# EAGLE design qcopter_lib_bb (EAGLE 7.5.0)
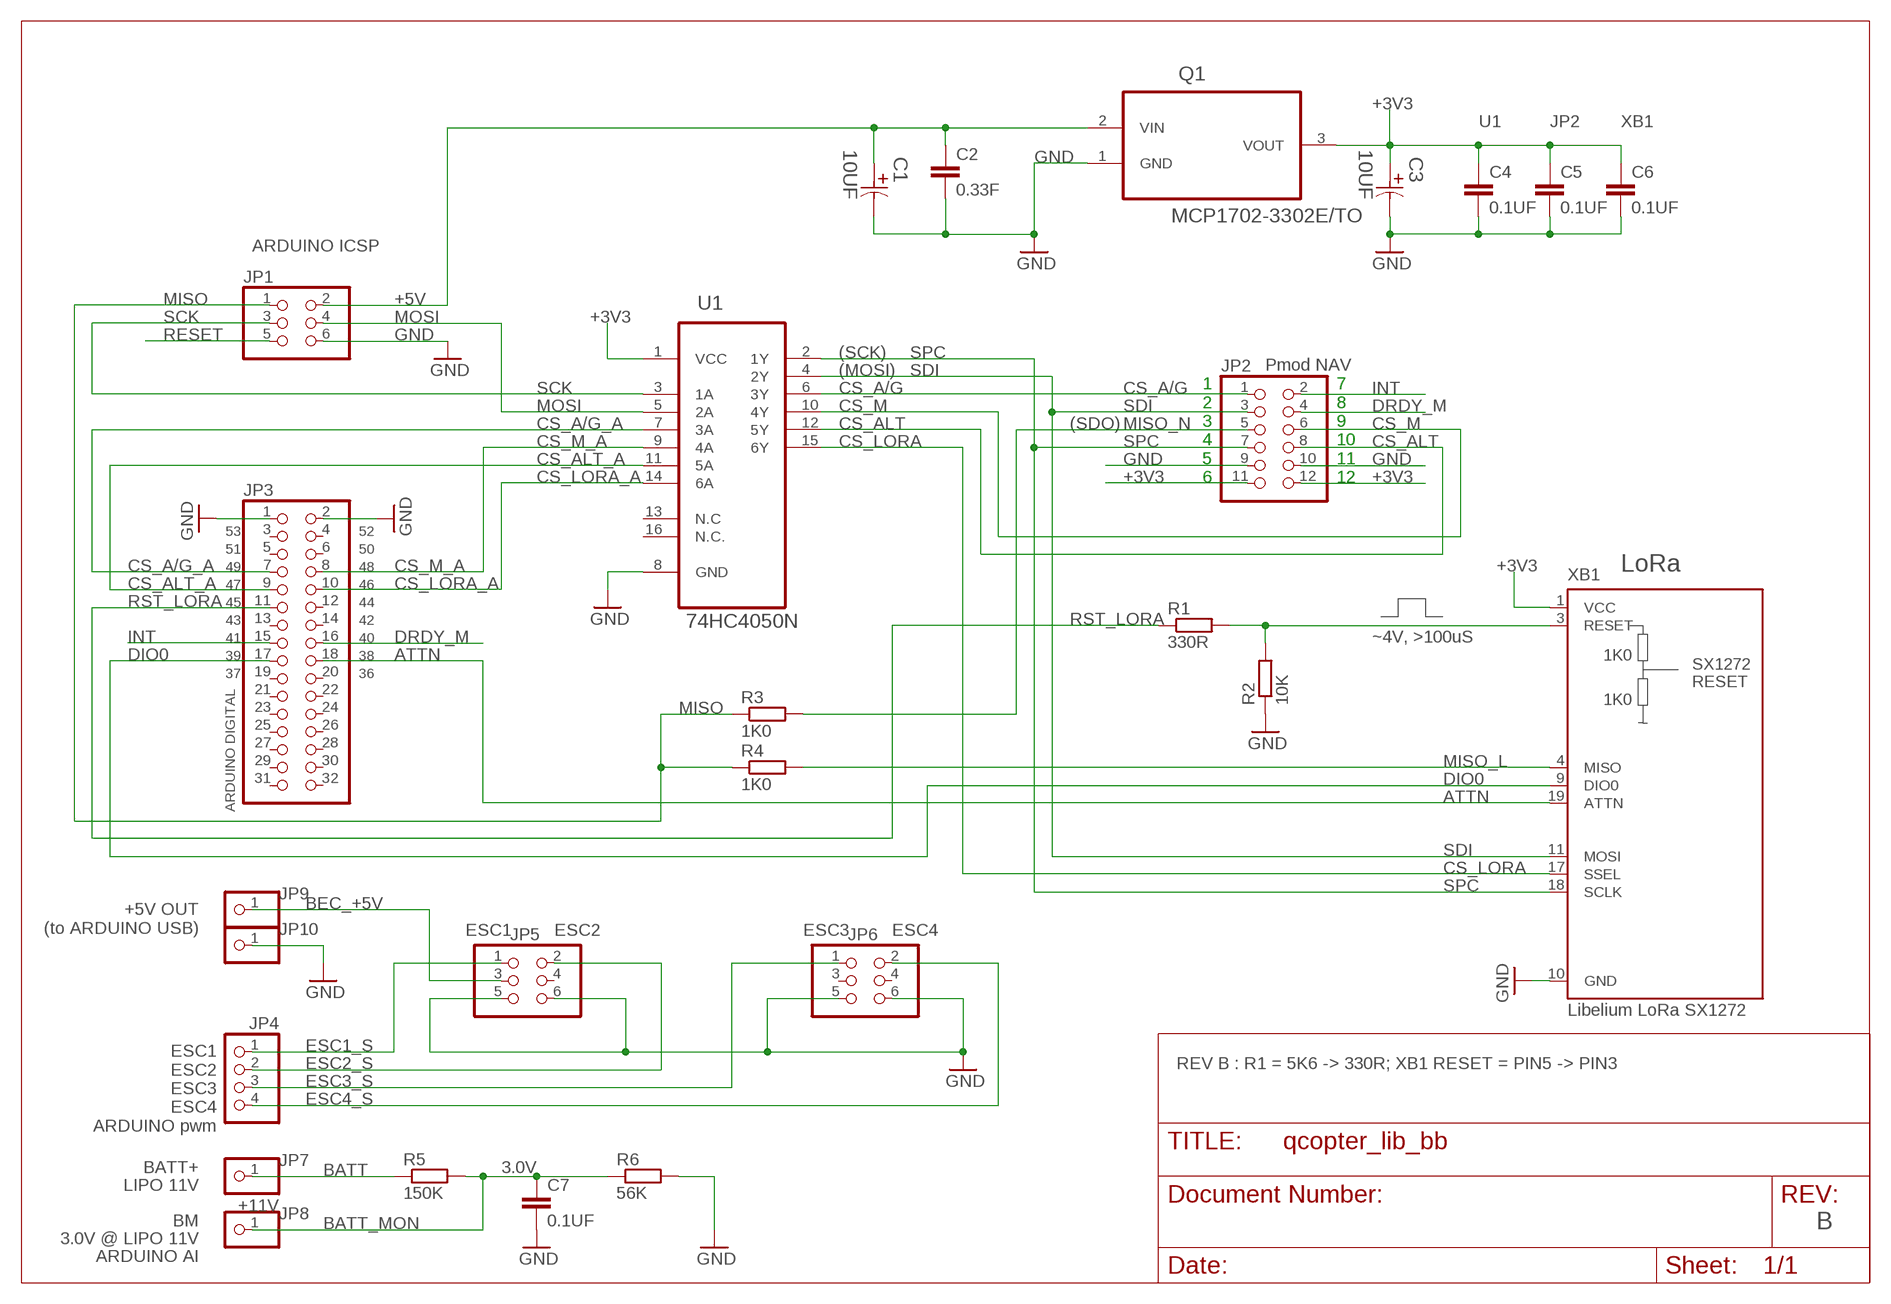
[diagram p0: schematic, sheet 1]

## Parts
C1  10UF  ECA1EHG470-D5XP2  [CAPPR200-500X1100]
C2  0.33F  C5/2.5  [C5B2.5]
C3  10UF  ECA1EHG470-D5XP2  [CAPPR200-500X1100]
C4  0.1UF  C5/2.5  [C5B2.5]
C5  0.1UF  C5/2.5  [C5B2.5]
C6  0.1UF  C5/2.5  [C5B2.5]
C7  0.1UF  C5/2.5  [C5B2.5]
JP1  PINHD-2X3  [2X03]
JP2  PINHD-2X6/90  [2X06/90]
JP3  PINHD-2X16  [2X16]
JP4  PINHD-1X4  [1X04]
JP5  PINHD-2X3  [2X03]
JP6  PINHD-2X3  [2X03]
JP7  +11V  PINHD-1X1  [1X01]
JP8  PINHD-1X1  [1X01]
JP9  PINHD-1X1  [1X01]
JP10  PINHD-1X1  [1X01]
Q1  MCP1702-3302E/TO  [TO127P254X533-3]
R1  330R  R-EU_0207/10  [0207/10]
R2  10K  R-EU_0207/10  [0207/10]
R3  1K0  R-EU_0207/10  [0207/10]
R4  1K0  R-EU_0207/10  [0207/10]
R5  150K  R-EU_0207/10  [0207/10]
R6  56K  R-EU_0207/10  [0207/10]
U1  74HC4050N  [DIP254P762X420-16]
XB1  Libelium LoRa SX1272  SX1272-LORA  [XBEE]

## Nets
+3V3: C3.1 C4.1 C5.1 C6.1 JP2.11 JP2.12 Q1.3(VOUT) U1.1(VCC) XB1.1(VCC)
+5V: C1.1 C2.1 JP1.2 Q1.2(VIN)
ATTN: JP3.18 XB1.19(ATTN)
BATT: JP7.1 R5.1
BATT_MON: C7.1 JP8.1 R5.2 R6.1
BEC_+5V: JP5.3 JP9.1
CS_A/G: JP2.1 U1.6(3Y)
CS_A/G_A: JP3.7 U1.7(3A)
CS_ALT: JP2.8 U1.12(5Y)
CS_ALT_A: JP3.9 U1.11(5A)
CS_LORA: U1.15(6Y) XB1.17(SSEL)
CS_LORA_A: JP3.10 U1.14(6A)
CS_M: JP2.6 U1.10(4Y)
CS_M_A: JP3.8 U1.9(4A)
DIO0: JP3.17 XB1.9(DIO0)
DRDY_M: JP2.4 JP3.16
ESC1_S: JP4.1 JP5.1
ESC2_S: JP4.2 JP5.2
ESC3_S: JP4.3 JP6.1
ESC4_S: JP4.4 JP6.2
GND: C1.2 C2.2 C3.2 C4.2 C5.2 C6.2 C7.2 JP1.6 JP2.9 JP2.10 JP3.1 JP3.2 JP5.5 JP5.6 JP6.5 JP6.6 JP10.1 Q1.1(GND) R2.1 R6.2 U1.8(GND) XB1.10(GND)
INT: JP2.2 JP3.15
MISO: JP1.1 R3.1 R4.1
MISO_L: R4.2 XB1.4(MISO)
MISO_N: JP2.5 R3.2
MOSI: JP1.4 U1.5(2A)
N$1: R1.2 R2.2 XB1.3(RESET)
RESET: JP1.5
RST_LORA: JP3.11 R1.1
SCK: JP1.3 U1.3(1A)
SDI: JP2.3 U1.4(2Y) XB1.11(MOSI)
SPC: JP2.7 U1.2(1Y) XB1.18(SCLK)
Unconnected: JP3.3 JP3.4 JP3.5 JP3.6 JP3.12 JP3.13 JP3.14 JP3.19 JP3.20 JP3.21 JP3.22 JP3.23 JP3.24 JP3.25 JP3.26 JP3.27 JP3.28 JP3.29 JP3.30 JP3.31 JP3.32 JP5.4 JP6.3 JP6.4 U1.13(N.C) U1.16(N.C.)

## Notes on the sheet
- U1 | JP2 | XB1
- ARDUINO ICSP
- (SCK) | Pmod NAV
- (MOSI)
- (SDO)
- 1
  2
  3
  4
  5
  6
- 7
  8
  9
  10
  11
  12
- 53 | 52
- 51 | 50
- 49 | 48 | LoRa
- 47 | 46
- 45 | 44
- 43 | 42
- 41 | 40 | ~4V, >100uS
- 39 | 38 | 1K0
- 37 | 36
- SX1272
  RESET
- 1K0
- ARDUINO DIGITAL
- +5V OUT
  (to ARDUINO USB)
- ESC1 | ESC2 | ESC3 | ESC4
- REV B : R1 = 5K6 -> 330R; XB1 RESET = PIN5 -> PIN3
- ESC1
  ESC2
  ESC3
  ESC4
  ARDUINO pwm
- BATT+ | 3.0V
- LIPO 11V
- BM
- B
- 3.0V @ LIPO 11V
- ARDUINO AI

## Library data of the parts
C1 C3 = Panasonic-ECA_01:ECA: Aluminum Electrolytic Capacitors/Radial Lead Type; MPN: ECA1EHG470; OC_FARNELL: 1848541; OC_NEWARK: 17T5002; PACKAGE: Radial Lead-TH; SUPPLIER: PANASONIC; TOLERANCE: ±20 %; VALUE: 47UF; VOLTAGERATING: 25V
C2 C4-C7 = capacitor-wima:C: CAPACITOR naming: grid - package width
JP1 JP5 JP6 = pinhead:PINHD-2X3: PIN HEADER
JP2 = pinhead:PINHD-2X6: PIN HEADER
JP3 = pinhead:PINHD-2X16: PIN HEADER
JP4 = pinhead:PINHD-1X4: PIN HEADER
JP7-JP10 = pinhead:PINHD-1X1: PIN HEADER
Q1 = Microchip-MCP1702-3302E-TO:MCP1702-3302E/TO: IC, V REG, LDO, 250MA; MPN: MCP1702-3302E/TO; OC_FARNELL: 1331485; OC_NEWARK: 34M7419; PACKAGE: TO-92; SUPPLIER: Microchip
R1-R6 = resistor:R-EU_: RESISTOR, European symbol
U1 = 74HC4050_DIP16:74HC4050N: Hex high-to-low level shifter,DIP-16; MPN: 74HC4050N; OC_FARNELL: 380908; OC_NEWARK: 07WX3736; PACKAGE: DIP-16; SUPPLIER: NXP
XB1 = xbee_lora:SX1272-LORA

## Board
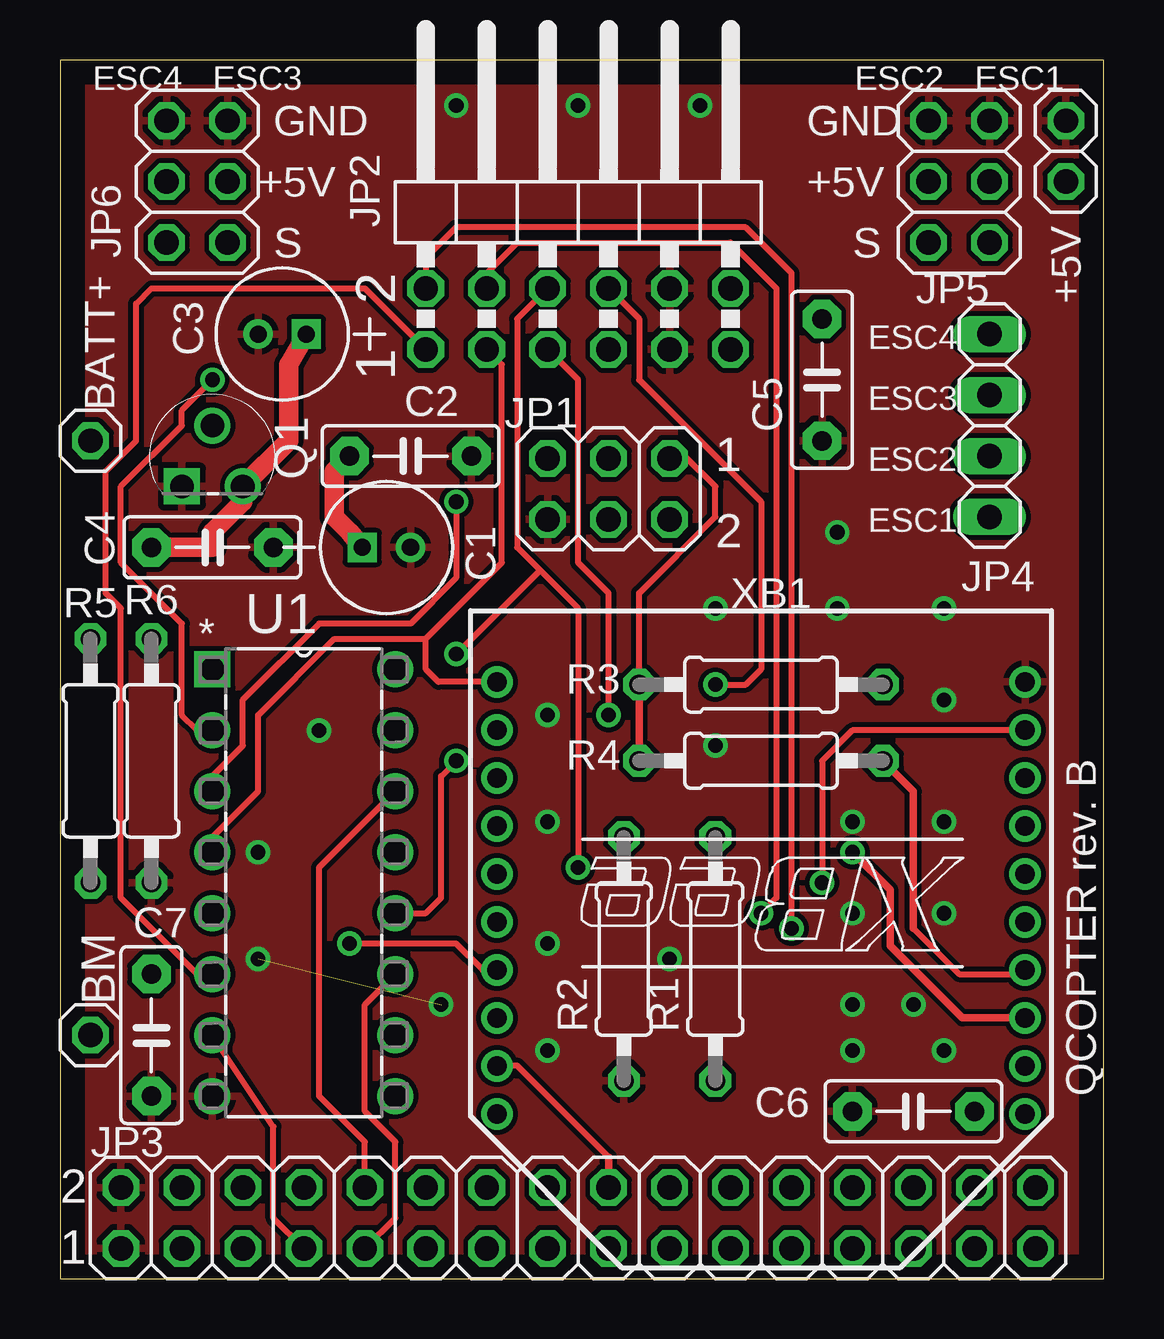
[diagram p1: board, top side]
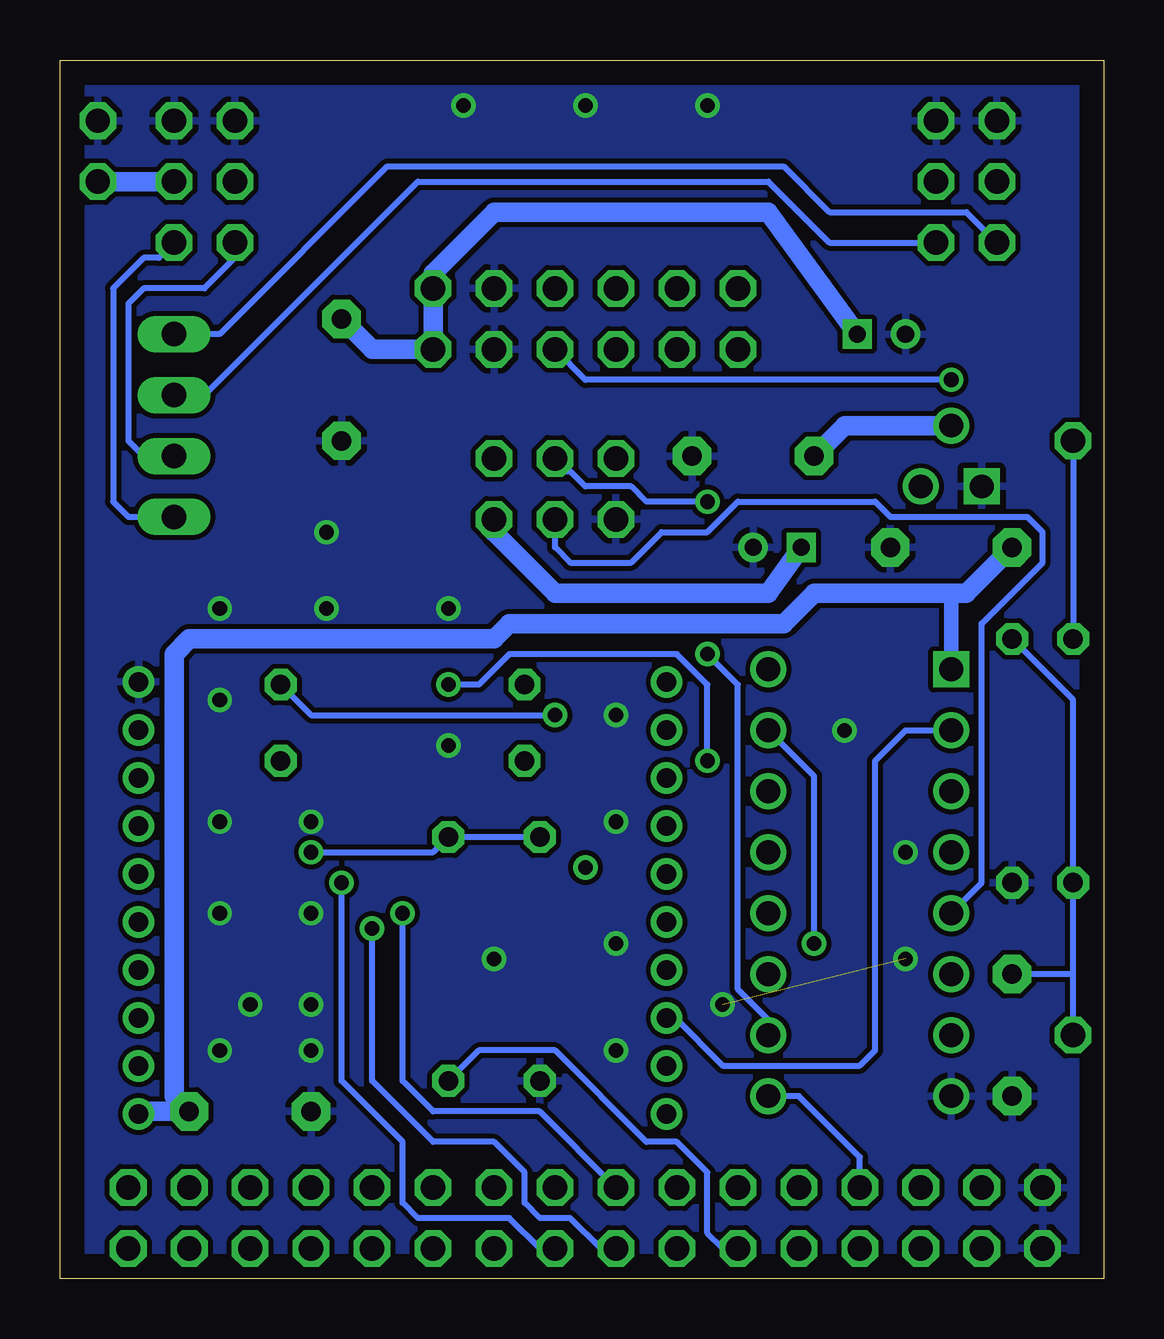
[diagram p2: board, bottom side, seen from below]

Size 43.48 x 50.79 mm. Coordinates in mm from the lower left corner, seen from the top.
Outline: 0,0 43.48,0 43.48,50.79 0,50.79 0,0
Copper layers (1*16): Top 0.035mm / dielectric 1.5mm / Bottom 0.035mm
Design rules "default": minimum track width 10mil, minimum drill 24mil, track to track 8mil, track to pad 8mil, pad to pad 8mil, via to via 8mil, smd to smd 8mil, copper to edge 40mil, drill to drill 8mil, minimum pad ring 10mil, minimum via ring 8mil, stop-mask expansion 4mil, vias tented up to drill 0mil, thermal gap 10mil

### Footprints (pad centres in the part's own frame; a part is rotated, then mirrored left to right if it is on the bottom)
CAPPR200-500X1100 = drill 0.711 square: 1 -2.007,0 | drill 0.711: 2 0,0
C5B2.5 = drill 0.813 pad 1.6 octagon: 1 -2.54,0; 2 2.54,0
2X03 = drill 1.016 octagon: 1 -2.54,-1.27; 2 -2.54,1.27; 3 0,-1.27; 4 0,1.27; 5 2.54,-1.27; 6 2.54,1.27
2X06/90 = drill 1.016 octagon: 1 -6.35,-6.35; 2 -6.35,-3.81; 3 -3.81,-6.35; 4 -3.81,-3.81; 5 -1.27,-6.35; 6 -1.27,-3.81; 7 1.27,-6.35; 8 1.27,-3.81; 9 3.81,-6.35; 10 3.81,-3.81; 11 6.35,-6.35; 12 6.35,-3.81
2X16 = drill 1.016 octagon: 1 -19.05,-1.27; 2 -19.05,1.27; 3 -16.51,-1.27; 4 -16.51,1.27; 5 -13.97,-1.27; 6 -13.97,1.27; 7 -11.43,-1.27; 8 -11.43,1.27; 9 -8.89,-1.27; 10 -8.89,1.27; 11 -6.35,-1.27; 12 -6.35,1.27; 13 -3.81,-1.27; 14 -3.81,1.27; 15 -1.27,-1.27; 16 -1.27,1.27; 17 1.27,-1.27; 18 1.27,1.27; 19 3.81,-1.27; 20 3.81,1.27; 21 6.35,-1.27; 22 6.35,1.27; 23 8.89,-1.27; 24 8.89,1.27; 25 11.43,-1.27; 26 11.43,1.27; 27 13.97,-1.27; 28 13.97,1.27; 29 16.51,-1.27; 30 16.51,1.27; 31 19.05,-1.27; 32 19.05,1.27
1X04 = drill 1.016 long: 1 -3.81,0; 2 -1.27,0; 3 1.27,0; 4 3.81,0
1X01 = drill 1.016 octagon: 1 0,0
TO127P254X533-3 = drill 0.991 square: 1 -2.54,-2.54 | drill 0.991: 2 -1.27,0; 3 0,-2.54
0207/10 = drill 0.813 octagon: 1 -5.08,0; 2 5.08,0
DIP254P762X420-16 = drill 0.991 square: 1 -7.62,17.78 | drill 0.991: 2 -7.62,15.24; 3 -7.62,12.7; 4 -7.62,10.16; 5 -7.62,7.62; 6 -7.62,5.08; 7 -7.62,2.54; 8 -7.62,0; 9 0,0; 10 0,2.54; 11 0,5.08; 12 0,7.62; 13 0,10.16; 14 0,12.7; 15 0,15.24; 16 0,17.78
XBEE = drill 0.8 pad 1.27: 1 -11,9; 2 -11,7; 3 -11,5; 4 -11,3; 5 -11,1; 6 -11,-1; 7 -11,-3; 8 -11,-5; 9 -11,-7; 10 -11,-9; 11 11,-9; 12 11,-7; 13 11,-5; 14 11,-3; 15 11,-1; 16 11,1; 17 11,3; 18 11,5; 19 11,7; 20 11,9

### Placement (x,y rotation side)
C1  14.61,30.48 0 top
C2  14.61,34.29 0 top
C3  8.26,39.37 180 top
C4  6.35,30.48 0 top
C5  31.75,37.47 270 top
C6  35.56,6.99 180 top
C7  3.81,10.16 270 top
JP1  22.86,32.92 180 top
JP2  21.59,45.09 0 top
JP3  21.59,2.54 0 top
JP4  38.73,35.56 90 top
JP5  37.47,45.72 90 top
JP6  5.71,45.72 90 top
JP7  1.27,34.92 0 top
JP8  1.27,10.16 0 top
JP9  41.91,45.72 0 top
JP10  41.91,48.26 0 top
Q1  7.62,35.56 0 top
R1  27.3,13.34 90 top
R2  23.5,13.34 90 top
R3  29.21,24.77 0 top
R4  29.21,21.59 0 top
R5  1.27,21.59 270 top
R6  3.81,21.59 270 top
U1  13.97,7.62 0 top
XB1  29.21,15.88 180 top

### Tracks (layer width: path | path; a pad name or v marks a point on that pad's centre or on a via)
+3V3
  Top 0.813: C4.1 6.35,30.48 6.35,31.11 7.62,32.38 Q1.3 9.53,34.92 9.53,38.1 C3.1
  Bottom 0.305: 40.1,6.99 XB1.1
  Bottom 0.61: U1.1 6.35,28.57
  Bottom 0.813: C4.1 5.71,28.57 6.35,28.57 12.06,28.57 13.34,27.3 24.77,27.3 25.4,26.67 38.1,26.67 38.73,26.04 38.73,7.62 C6.1 40.1,6.99 | C3.1 13.97,44.45 25.4,44.45 27.94,41.91 JP2.12 JP2.11 30.48,38.73 C5.1
+5V
  Top 0.813: C2.1 11.43,33.66 11.43,31.75 12.06,31.11 C1.1
  Bottom 0.813: Q1.2 10.79,35.56 C2.1 | C1.1 13.97,28.57 22.86,28.57 25.4,31.11 JP1.2
ATTN
  Top 0.254: 22.86,5.08 19.05,8.89 18.23,8.89
  Top 0.305: JP3.18 22.86,5.08 | 18.23,8.89 XB1.19
BATT
  Bottom 0.254: JP7.1 R5.1
BATT_MON
  Bottom 0.254: R6.1 1.27,24.13 R5.2 1.27,12.7 | JP8.1 1.27,12.7 | 1.27,12.7 C7.1
BEC_+5V
  Bottom 0.813: JP9.1 JP5.3
CS_A/G
  Top 0.254: JP2.1 12.7,41.27 3.81,41.27 3.17,40.64 3.17,34.92 1.91,33.66 1.91,28.57 2.54,27.94 2.54,15.88 5.71,12.7
  Top 0.305: U1.6 5.71,12.7
CS_A/G_A
  Top 0.254: U1.7 8.89,6.35 8.89,2.54 JP3.7
CS_ALT  (via drill 0.61)
  Top 0.254: JP2.8 24.13,40.01 24.13,37.47 29.21,32.38 29.21,25.4 28.57,24.77 v27.3,24.77 | U1.12 15.24,15.24 15.88,15.88 15.88,20.95 v16.51,21.59
  Bottom 0.254: v16.51,21.59 16.51,24.77 17.78,26.04 24.77,26.04 26.04,24.77 v27.3,24.77
CS_ALT_A
  Top 0.254: JP3.9 13.97,2.54 13.97,5.71 12.7,6.99 12.7,11.43 U1.11
CS_LORA  (via drill 0.61)
  Top 0.254: XB1.17 17.61,12.88 16.51,13.97 v12.06,13.97
  Bottom 0.254: v12.06,13.97 12.06,20.95 U1.15
CS_LORA_A
  Top 0.254: JP3.10 12.7,5.71 10.79,7.62 10.79,17.14 U1.14
CS_M  (via drill 0.61)
  Top 0.254: v21.59,17.14 21.59,27.94 20,29.53 | 20,29.53 19.05,30.48 19.05,40.01 JP2.6 | v16.51,26.04 20,29.53
  Bottom 0.254: U1.10 13.97,10.79 15.24,12.06 15.24,24.77 v16.51,26.04
CS_M_A
  Bottom 0.254: JP3.8 10.16,5.08 12.7,7.62 U1.9
DIO0  (via drill 0.61)
  Top 0.254: 40.2,22.86 33.02,22.86 31.75,21.59 v31.75,16.51
  Top 0.305: 40.2,22.86 XB1.9
  Bottom 0.254: JP3.17 23.5,1.27 24.77,2.54 28.57,2.54 29.21,3.17 29.21,5.71 31.75,8.26 v31.75,16.51
DRDY_M  (via drill 0.61)
  Top 0.254: v29.21,15.24 29.84,15.88 29.84,41.27 27.94,43.18 19.05,43.18 17.78,41.91 JP2.4
  Bottom 0.254: JP3.16 23.5,6.99 27.94,6.99 29.21,8.26 v29.21,15.24
ESC1_S
  Bottom 0.254: JP5.1 39.37,42.55 40.01,42.55 41.27,41.27 41.27,32.38 40.64,31.75 JP4.1 38.1,31.75
ESC2_S
  Bottom 0.254: JP5.2 36.2,42.55 37.47,41.27 40.01,41.27 40.64,40.64 40.64,34.92 40.01,34.29 JP4.2
ESC3_S
  Bottom 0.254: JP6.1 11.43,43.18 13.97,45.72 28.57,45.72 37.47,36.83 JP4.3
ESC4_S
  Bottom 0.254: JP6.2 5.71,44.45 11.43,44.45 13.34,46.35 29.84,46.35 36.83,39.37 JP4.4
GND  (via drill 0.61)  (1 unrouted)
  other vias: 16.51,48.9 21.59,48.9 26.67,48.9 27.3,27.94 27.3,22.23 36.83,27.94 36.83,24.13 33.02,19.05 33.02,15.24 33.02,11.43 33.02,9.53 20.32,9.53 25.4,13.34 36.83,19.05 36.83,15.24 35.56,11.43 36.83,9.53 8.26,13.34 8.26,17.78 10.79,22.86 15.88,11.43 20.32,13.97 32.38,27.94 32.38,31.11 20.32,23.5 20.32,19.05
  pour Bottom: 0,0 0,50.8 43.18,50.8 43.18,49.53 43.18,0
  pour Top: 0,0 0,50.8 43.18,50.8 43.18,0
INT  (via drill 0.61)
  Top 0.254: v30.48,14.61 30.48,41.91 28.57,43.81 16.51,43.81 15.24,42.55 JP2.2
  Bottom 0.254: JP3.15 20.95,1.27 22.23,2.54 23.5,2.54 24.13,3.17 24.13,4.45 25.4,5.71 27.94,5.71 30.48,8.26 v30.48,14.61
MISO
  Top 0.254: R3.1 24.13,28.57 27.3,31.75 27.3,33.02 26.04,34.29 25.5,34.29
  Top 0.305: R4.1 R3.1 | 25.5,34.29 JP1.1
MISO_L
  Top 0.254: 35.56,14.61 37.47,12.7 40.03,12.7 XB1.4
  Top 0.305: 35.56,14.61 35.56,20.32 R4.2
MISO_N  (via drill 0.61)
  Top 0.254: v22.86,23.5 22.86,28.57 21.59,29.84 21.59,37.47 JP2.5
  Bottom 0.254: R3.2 33.02,23.5 v22.86,23.5
MOSI
  Bottom 0.254: JP1.4 22.86,30.48 22.23,29.84 19.68,29.84 18.41,31.11 16.51,31.11 15.24,32.38 9.53,32.38 8.89,31.75 3.17,31.75 2.54,31.11 2.54,29.84 5.08,27.3 5.08,16.51 U1.5
N$1  (via drill 0.61)
  Top 0.305: XB1.3 37.6,10.88 34.59,13.89 34.59,16.21 v33.02,17.78
  Bottom 0.254: R2.2 R1.2 27.94,17.78 v33.02,17.78
RST_LORA
  Bottom 0.254: JP3.11 15.88,1.27 16.51,1.91 16.51,4.45 17.78,5.71 19.05,5.71 22.86,9.53 26.04,9.53 R1.1
SCK  (via drill 0.61)
  Top 0.254: v16.51,32.38 16.51,29.21 14.61,27.3 10.79,27.3 7.62,24.13 7.62,22.23 6.35,20.95 U1.3
  Bottom 0.254: JP1.3 22.86,33.66 22.23,33.66 21.59,33.02 19.68,33.02 19.05,32.38 v16.51,32.38
SDI
  Top 0.254: JP2.3 18.41,38.1 18.41,29.84 15.24,26.67 | 15.24,26.67 11.43,26.67 8.26,23.5 8.26,20.32 6.35,18.41 U1.4 | XB1.11 15.77,24.88 15.24,25.4 15.24,26.67
SPC  (via drill 0.61)
  Top 0.254: 5.71,22.86 5.08,23.5 5.08,27.3 2.54,29.84 2.54,33.02 5.08,35.56 5.08,36.2 v6.35,37.47
  Top 0.305: U1.2 5.71,22.86
  Bottom 0.254: XB1.18 17.86,10.88 15.88,8.89 10.16,8.89 9.53,9.53 9.53,21.59 8.26,22.86 U1.2 | v6.35,37.47 21.59,37.47 JP2.7

### Text on the board
tNames: ESC4 | ESC3 | ESC2 | ESC1 | GND | GND | +5V | +5V | S | S | 2 | +5V | ESC4 | 1 | BATT+ | ESC3 | 1 | ESC2 | ESC1 | 2 | BM | QCOPTER rev. B | 2 | 1